# Altium schematic sheet Digital Inputs.SchDoc
size A3; SheetNumber: 2; SheetTotal: 7
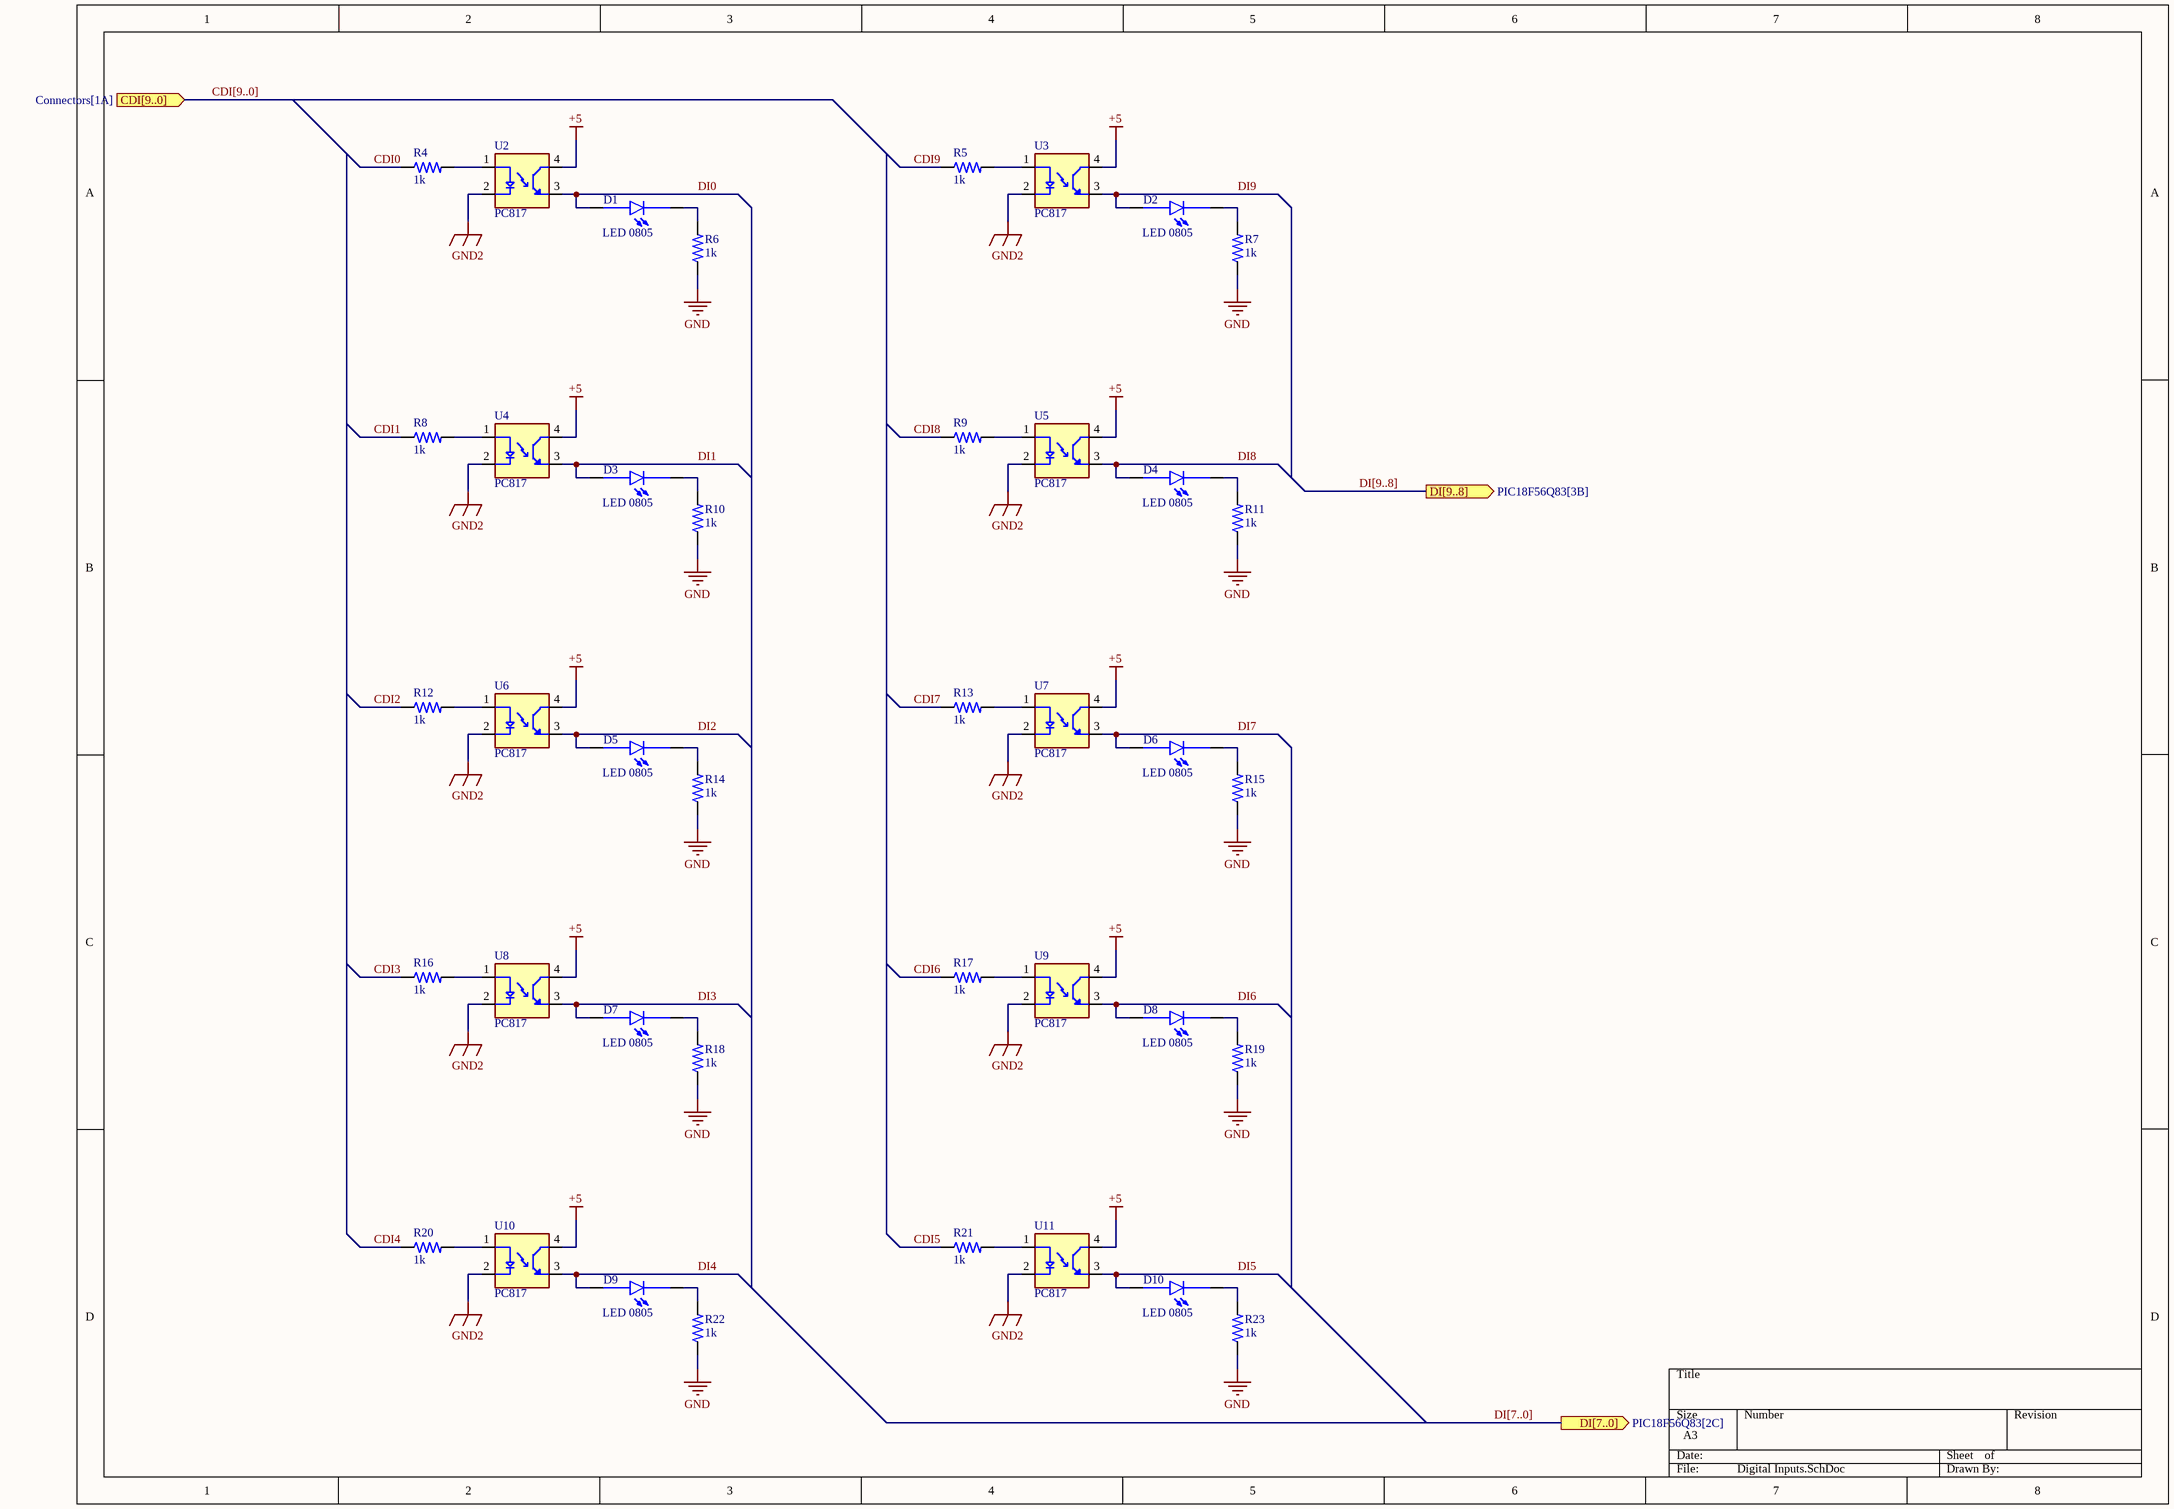
[diagram p0: Digital Inputs.SchDoc]

## Parts
D1  LED 0805  [LED 0805]
D2  LED 0805  [LED 0805]
D3  LED 0805  [LED 0805]
D4  LED 0805  [LED 0805]
D5  LED 0805  [LED 0805]
D6  LED 0805  [LED 0805]
D7  LED 0805  [LED 0805]
D8  LED 0805  [LED 0805]
D9  LED 0805  [LED 0805]
D10  LED 0805  [LED 0805]
R4  1k  [0805]
R5  1k  [0805]
R6  1k  [0805]
R7  1k  [0805]
R8  1k  [0805]
R9  1k  [0805]
R10  1k  [0805]
R11  1k  [0805]
R12  1k  [0805]
R13  1k  [0805]
R14  1k  [0805]
R15  1k  [0805]
R16  1k  [0805]
R17  1k  [0805]
R18  1k  [0805]
R19  1k  [0805]
R20  1k  [0805]
R21  1k  [0805]
R22  1k  [0805]
R23  1k  [0805]
U2  PC817  [PC817]
U3  PC817  [PC817]
U4  PC817  [PC817]
U5  PC817  [PC817]
U6  PC817  [PC817]
U7  PC817  [PC817]
U8  PC817  [PC817]
U9  PC817  [PC817]
U10  PC817  [PC817]
U11  PC817  [PC817]

## Ports
CDI[9..0] (in, see Connectors[1A]), DI[7..0] (out, see PIC18F56Q83[2C]), DI[9..8] (out, see PIC18F56Q83[3B])

## Nets
+5: U2.4(CT) U3.4(CT) U4.4(CT) U5.4(CT) U6.4(CT) U7.4(CT) U8.4(CT) U9.4(CT) U10.4(CT) U11.4(CT)
GND: R6.1 R7.1 R10.1 R11.1 R14.1 R15.1 R18.1 R19.1 R22.1 R23.1
GND2: U2.2(C) U3.2(C) U4.2(C) U5.2(C) U6.2(C) U7.2(C) U8.2(C) U9.2(C) U10.2(C) U11.2(C)
CDI0: R4.1
CDI1: R8.1
CDI2: R12.1
CDI3: R16.1
CDI4: R20.1
CDI5: R21.1
CDI6: R17.1
CDI7: R13.1
CDI8: R9.1
CDI9: R5.1
DI0: D1.A U2.3(ET)
DI1: D3.A U4.3(ET)
DI2: D5.A U6.3(ET)
DI3: D7.A U8.3(ET)
DI4: D9.A U10.3(ET)
DI5: D10.A U11.3(ET)
DI6: D8.A U9.3(ET)
DI7: D6.A U7.3(ET)
DI8: D4.A U5.3(ET)
DI9: D2.A U3.3(ET)
NetD1_C: D1.C R6.2
NetD2_C: D2.C R7.2
NetD3_C: D3.C R10.2
NetD4_C: D4.C R11.2
NetD5_C: D5.C R14.2
NetD6_C: D6.C R15.2
NetD7_C: D7.C R18.2
NetD8_C: D8.C R19.2
NetD9_C: D9.C R22.2
NetD10_C: D10.C R23.2
NetR4_2: R4.2 U2.1(A)
NetR5_2: R5.2 U3.1(A)
NetR8_2: R8.2 U4.1(A)
NetR9_2: R9.2 U5.1(A)
NetR12_2: R12.2 U6.1(A)
NetR13_2: R13.2 U7.1(A)
NetR16_2: R16.2 U8.1(A)
NetR17_2: R17.2 U9.1(A)
NetR20_2: R20.2 U10.1(A)
NetR21_2: R21.2 U11.1(A)

## Buses and harness runs
bus CDI[9..0] = port CDI[9..0]
bus DI[7..0] = port DI[7..0]
bus DI[9..8] = port DI[9..8]

## Library data of the parts
D1-D10 = LED 0805: LED Uni-Color Green 4-Pin Chip 0805 T/R; MP: 597-3305-607F; Availability: Unavailable; Value: *; Price: None; Package: None
R4-R23 = 0805_Resistor: Power_Rating: .25 W; MP: 2-2176053-0; Tolerance: 1%; Resistance: .33; MF: TE Connectivity; Price: None; Availability: In Stock; EU_RoHS_Compliance: Compliant with Exemptions; Package: 0805; Value: *; SnapEDA_Link: https://www.snapeda.com/parts/2-2176053-0/TE+Connectivity/view-part/?ref=snap; Check_prices: https://www.snapeda.com/parts/2-2176053-0/TE+Connectivity/view-part/?ref=eda
U2-U11 = PC817: Optoisolator Transistor Output 5000Vrms 1 Channel 4-SMD; MP: PC817XI; MF: Sharp Microelectronics; Price: None; Availability: In Stock; Package: SMD-4 Sharp Microelectronics; Value: *; SnapEDA_Link: https://www.snapeda.com/parts/PC817XI/Sharp+Microelectronics/view-part/?ref=snap; Purchase-URL: https://pricing.snapeda.com/search/part/PC817XI/?ref=eda; Check_prices: https://www.snapeda.com/parts/PC817XI/Sharp+Microelectronics/view-part/?ref=eda